# Altium schematic sheet [02] - BLOCK DIAGRAM.SchDoc
size A3; DocumentNumber: 2; SheetNumber: 2; SheetTotal: 5; PageSetup: Record=PageOptions|CenterHorizontal=True|CenterVertical=True|PrintScale=0.52|XCorrection=1.00|YCorrection=1.00|PrintKind=1|BorderSize=5000000|LeftOffset=0|BottomOffset=0|Orientation=2|PaperLength=1000|PaperWidth=1000|Scale=100|PaperSource=4|PrintQuality=600|MediaType=1|DitherType=10|PrintScaleMode=1|PaperKind=A4|PaperIndex=9
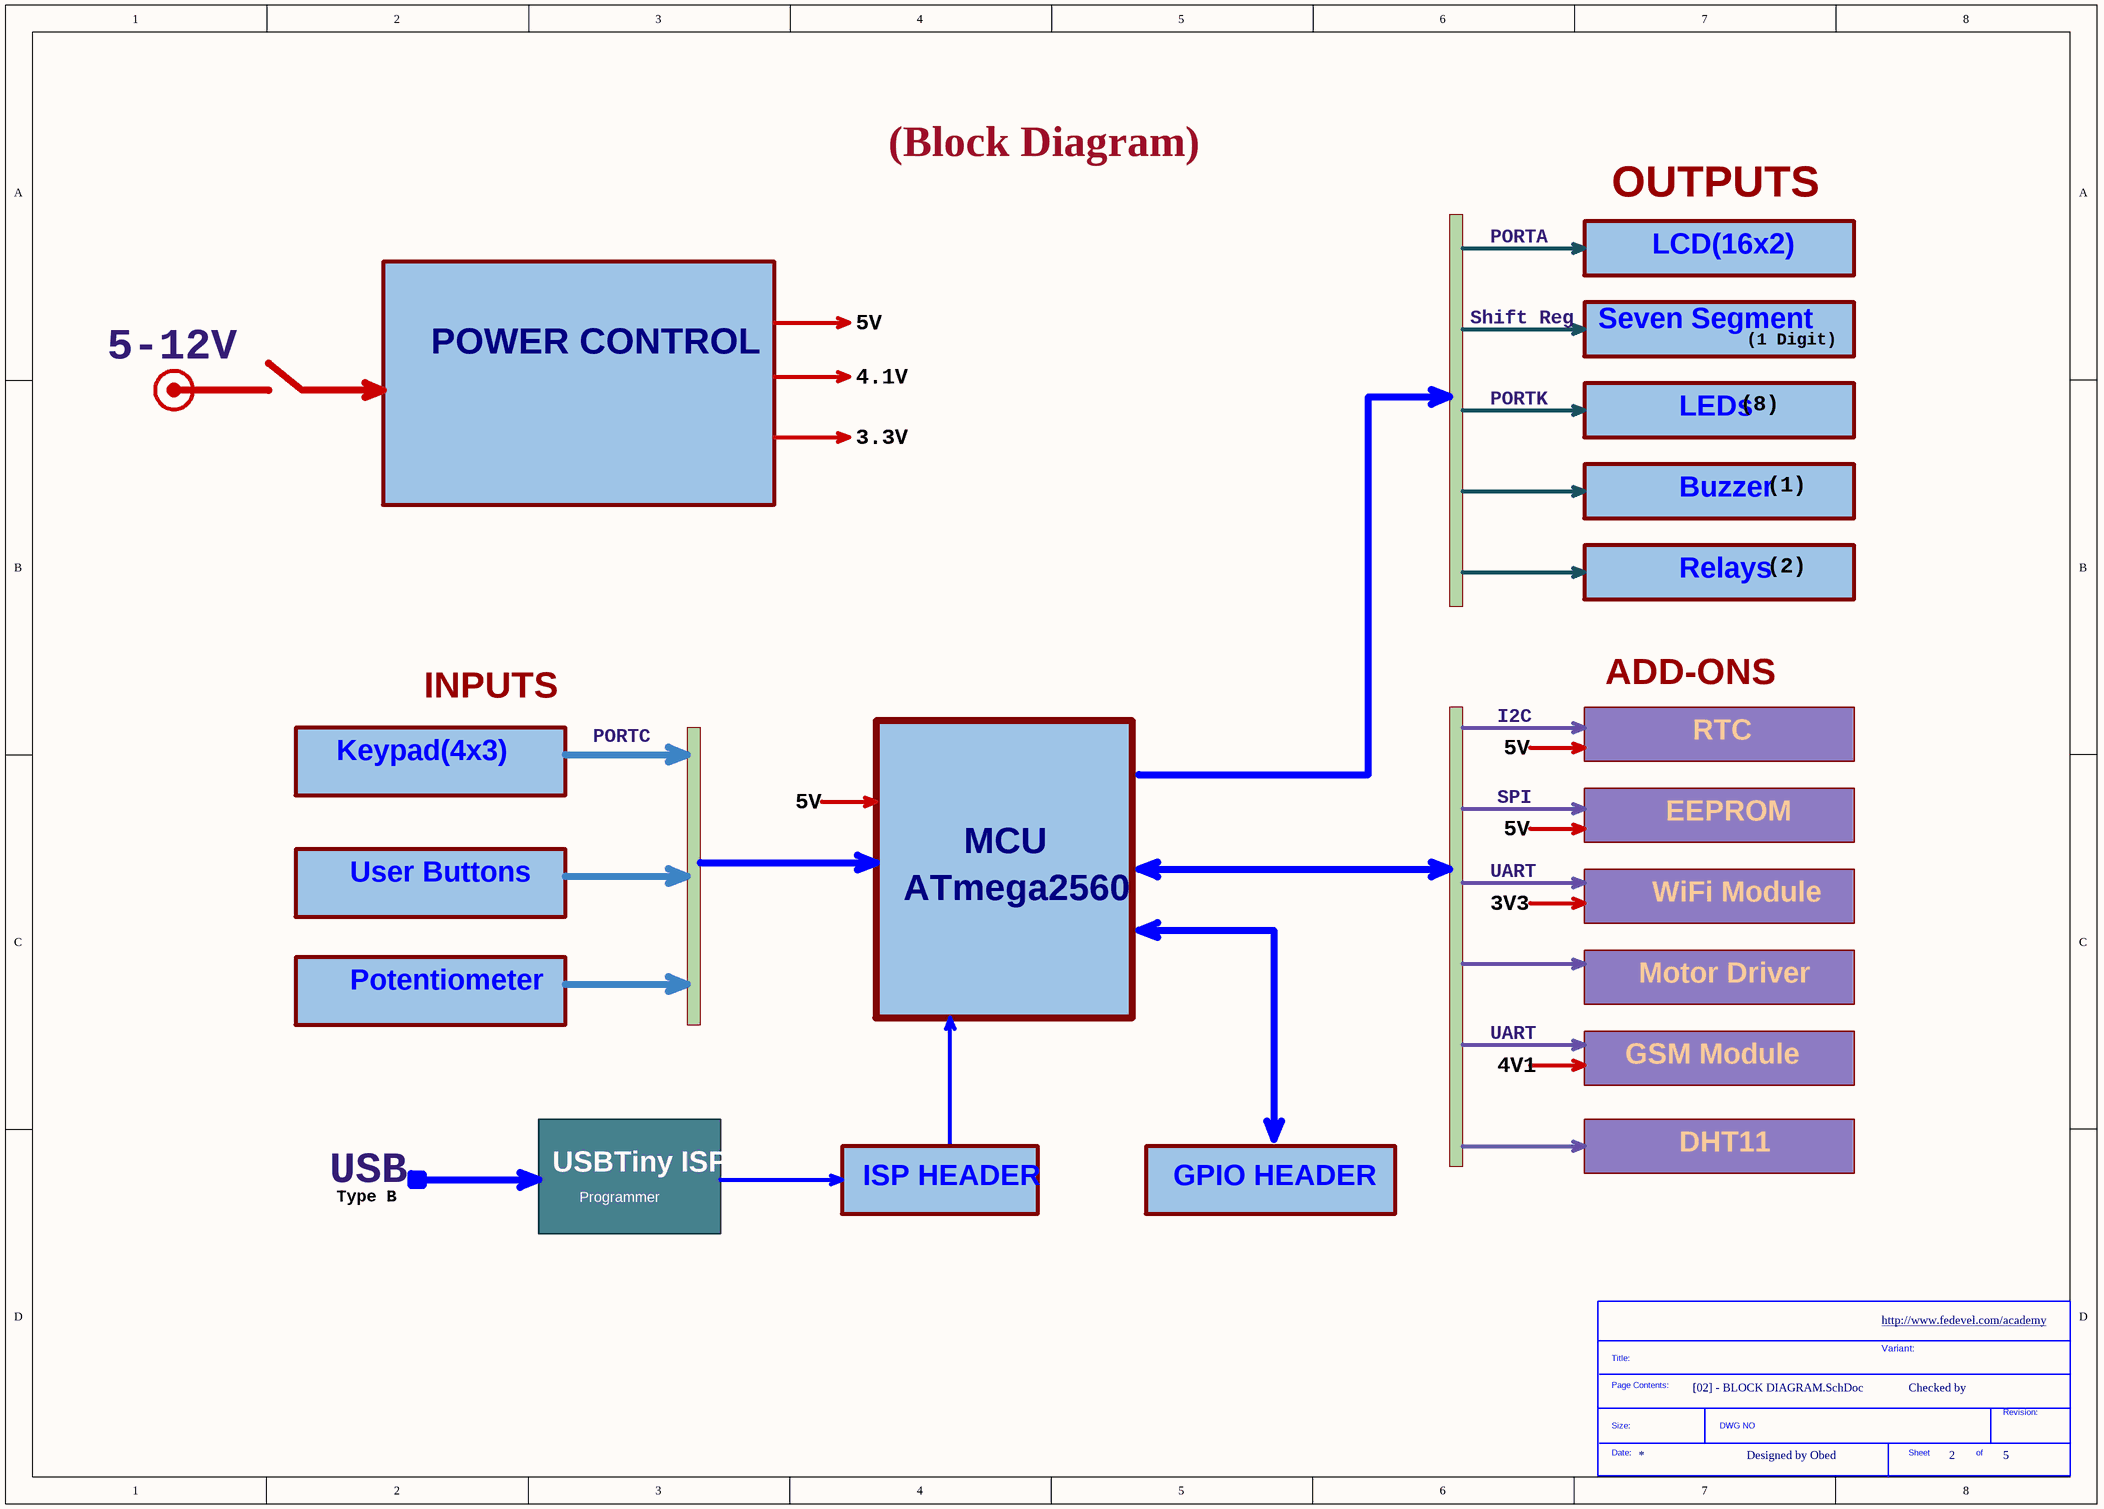
[diagram p0: [02] - BLOCK DIAGRAM.SchDoc]

## Parts
*  SDTitleBlock  (value not drawn)  (graphical)

## Notes on the sheet
- (Block Diagram)
- PORTA
- OUTPUTS
- LCD(16x2)
- 5-12V
- POWER CONTROL
- 5V
- Shift Reg
- Seven Segment
- (1 Digit)
- 4.1V
- 3.3V
- PORTK
- LEDs
- (8)
- Buzzer
- (1)
- Relays
- (2)
- INPUTS
- I2C
- ADD-ONS
- Keypad(4x3)
- PORTC
- RTC
- MCU
- SPI
- EEPROM
- User Buttons
- ATmega2560
- UART
- 3V3
- WiFi Module
- Potentiometer
- Motor Driver
- 4V1
- GSM Module
- USB
- USBTiny ISP
- ISP HEADER
- GPIO HEADER
- DHT11
- Type B
- Programmer
- http://www.fedevel.com/academy
- Variant:
- Checked by
- Designed by Obed
- (in symbol SDTitleBlock) Title:; Page Contents:; Revision:; Size:; DWG NO; Date:; Sheet; of